# EAGLE board Seeeduino LoRaWan (EAGLE 7.6.0)
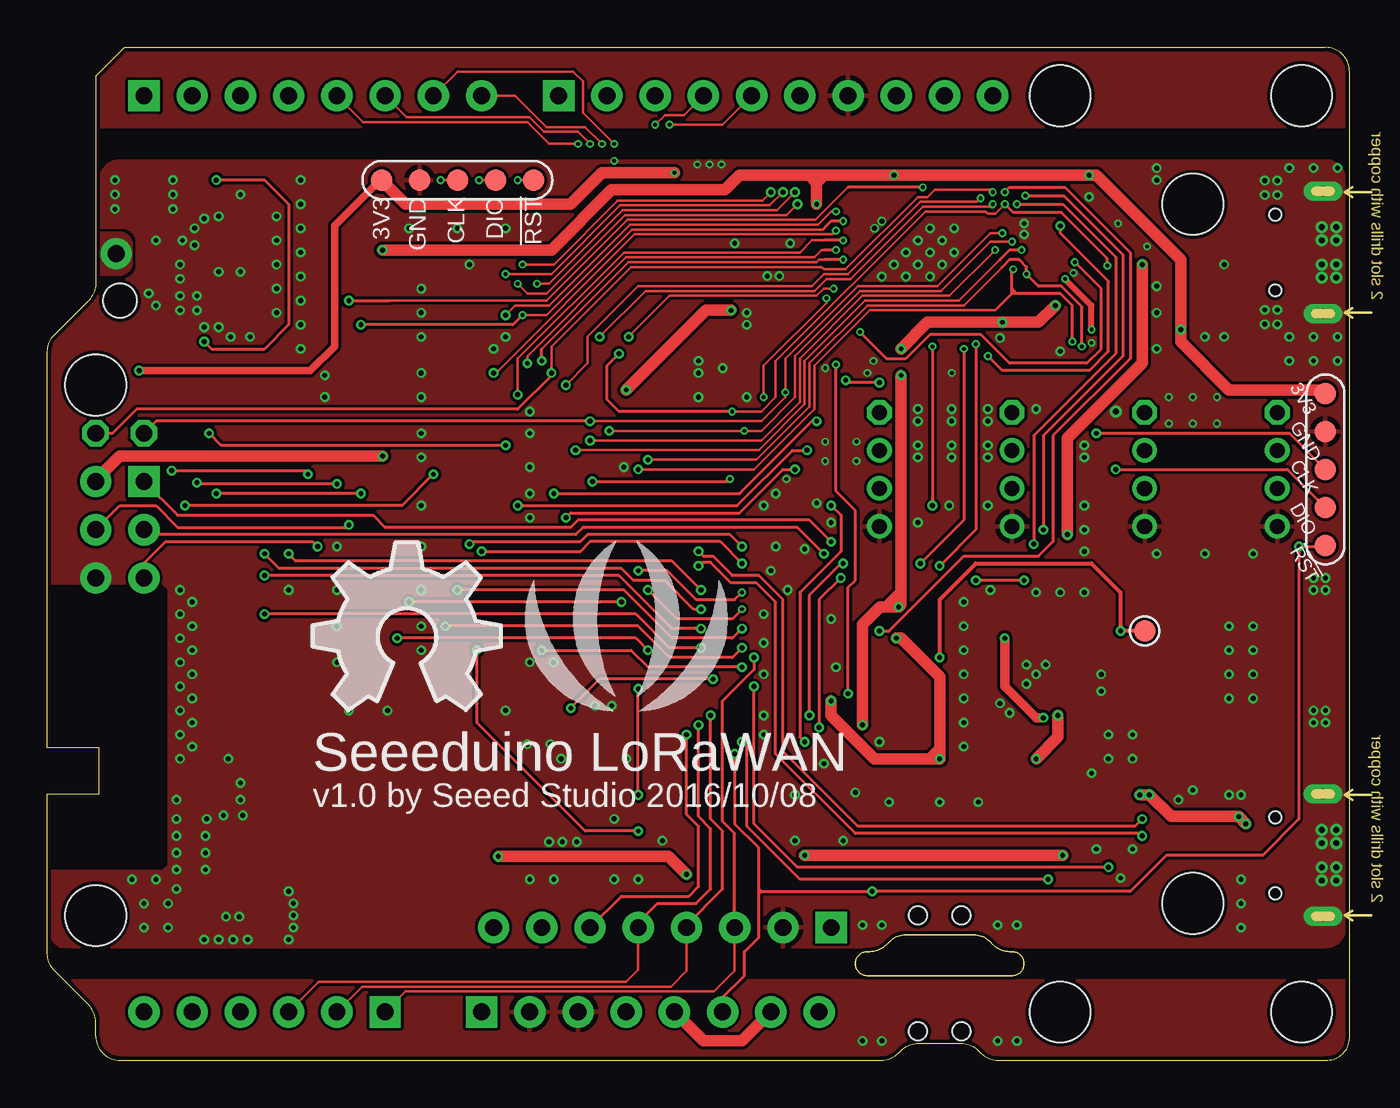
[diagram p2: board, top side]
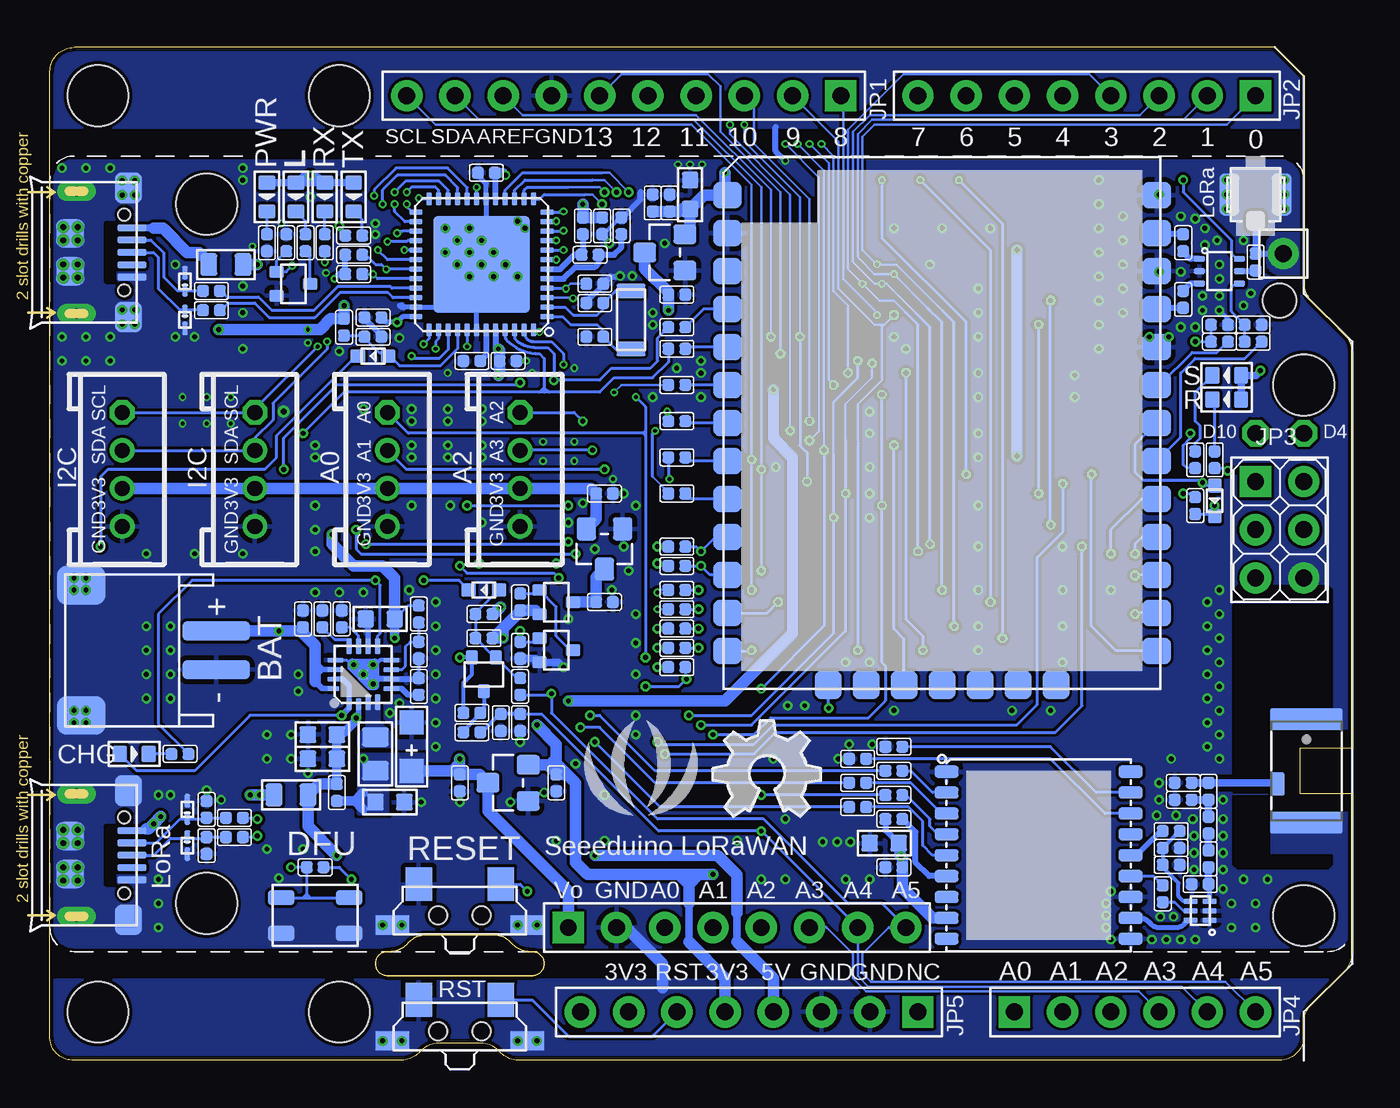
[diagram p3: board, bottom side, seen from below]

Size 68.58 x 53.34 mm. Coordinates in mm from the lower left corner, seen from the top.
Outline: 43.29,5.72 arc45 44.19,6.09 44.33,6.23 arc-45 45.23,6.6 48.75,6.6 arc-45 49.65,6.23 49.79,6.09 arc45 50.69,5.72
Outline: 50.67,5.72 50.8,5.72 arc-90 51.44,5.08 arc-90 50.8,4.45 43.18,4.45 arc-90 42.55,5.08 arc-90 43.18,5.72 43.31,5.72
Outline: 68.58,52.07 arc90 67.31,53.34 4.06,53.34 2.54,51.82 2.54,40.91 arc-45 2.17,40.01 0.37,38.22 arc45 0,37.32 0,16.45 2.73,16.45 2.73,14.03 0,14.03 0,5.61 arc45 0.37,4.71 2.17,2.91 arc-45 2.54,2.01 2.54,1.27 arc90 3.81,0 43.92,0 arc45 44.82,0.37 44.97,0.52 arc-45 45.87,0.89 48.12,0.89 arc-45 49.01,0.52 49.16,0.37 arc45 50.06,0 67.31,0 arc90 68.58,1.14 68.58,52.07
Copper layers (1*16): Top 0.035mm / dielectric 1.5mm / Bottom 0.035mm
Design rules "default *": minimum track width 1mil, minimum drill 8mil, track to track 5mil, track to pad 5mil, pad to pad 5mil, via to via 5mil, smd to smd 0mil, copper to edge 8mil, drill to drill 8mil, minimum pad ring 4mil, minimum via ring 4mil, stop-mask expansion 4mil, vias tented up to drill 20mil, thermal gap 10mil
Net classes: 0 default: width 0.025 mm, drill 0.203 mm, clearance 0.127 mm
Holes 3.2 mm at 60.33,45.09 60.33,8.26 66.04,2.54 66.04,50.8 53.34,2.54
Holes 1.78 mm at 3.81,40.01
tRestrict: area 2.5,47.6 to 68.6,48.9; area 0,4.4 to 68.6,5.7; 12 lines
bRestrict: area 42.9,39 to 48.8,44.8; area 51.1,19.3 to 53.1,21.3; area 6.1,14.2 to 7.8,15.1; area 0,4.4 to 68.6,5.7; area 2.5,47.6 to 68.6,48.9; 12 lines
Milling: area 42.5,4.4 to 51.4,6.6

## Footprints (pad centres in the part's own frame; a part is rotated, then mirrored left to right if it is on the bottom)
4P-2.0 = drill 0.8 pad 1.3 octagon: 1 -3,0 | drill 0.8 pad 1.3: 2 -1,0; 3 1,0; 4 3,0
1P-65/35MIL = drill 0.889 pad 1.651: 1 0,0
ANT3-SMD-5.2X3.7X0.7MM = smd 0.75 x 1.2: 1 1.525,0.7 | smd 3.8 x 1.15: 2 0,2.725; 3 0,-2.725
U-FL3P-SMD-2.6X2.6X1.0MM = smd 1.05 x 1: D -1.397,0 | smd 2.2 x 1.05: GND1 0,1.373; GND2 0,-1.373
HW2-SMD-2.0-90D = smd 2.032 x 2.54: 3 3.429,-2.159; 4 -3.429,-2.159 | smd 1.016 x 3.556: + -1.016,4.953; - 1.016,4.953
C0402 = smd 0.635 x 0.635: 1 -0.445,0; 2 0.445,0
C0603 = smd 0.889 x 0.889: 1 -0.762,0; 2 0.762,0
AVX-A = smd 1.27 x 1.27: + -1.27,0; - 1.27,0
LED-0603 = smd 0.762 x 0.889: + -0.762,0; - 0.762,0
SOD523 = smd 0.762 x 0.7: + -0.8,0; - 0.8,0
SOD-923 = smd 0.7 x 0.3: 1 -0.45,0; 2 0.45,0
MICRO-USB = smd 0.381 x 1.524: 1 -1.3,-0.25; 2 -0.65,-0.25; 3 0,-0.25; 4 0.65,-0.25; 5 1.3,-0.25 | smd 1.6 x 1.397: S1 -3.4,-0.427; S6 3.4,-0.427 | drill 0.508 pad 1.016 long: S2 -3.226,-3.175; S5 3.226,-3.175 | smd 1.5 x 1.5: S3 -1,-3.5; S4 1,-3.5 | hole 0.635: -2,-0.65; 2,-0.65
SW4P-SMD-4.5X3.2X2.5MM = smd 1.4 x 0.8: 1 -1.8,-0.94; 2 1.8,-0.94; 3 1.8,0.94; 4 -1.8,0.94
R0805 = smd 0.9 x 1.2: 1 -0.9,0; 2 0.9,0
H5-SMD-2.0-TEST = smd 1.143 x 1.143: 1 0,4; 2 0,2; 3 0,0; 4 0,-2; 5 0,-4
8P-2.54-65/35MIL = drill 0.889 pad 1.651 square: 1 0,8.89 | drill 0.889 pad 1.651: 2 0,6.35; 3 0,3.81; 4 0,1.27; 5 0,-1.27; 6 0,-3.81; 7 0,-6.35; 8 0,-8.89
L0402 = smd 0.635 x 0.635: 1 -0.445,0; 2 0.445,0
L0805 = smd 1.016 x 1.397: 1 -0.889,0; 2 0.889,0
SOT-323 = smd 0.635 x 0.762: 1 -0.635,-0.889; 2 0.635,-0.889; 3 0,0.889
SOT323 = smd 0.635 x 0.762: 1 -0.635,-0.889; 2 0.635,-0.889; 3 0,0.889
R0402 = smd 0.635 x 0.635: 1 -0.445,0; 2 0.445,0
4P-SMD-7.0X3.5X3.5H-90D = smd 1.397 x 1.778: 1 -2.159,1.651; 2 2.159,1.651 | smd 1.778 x 1.016: S1 -3.556,-0.508; S2 3.556,-0.508 | hole 0.95: -1.15,0; 1.15,0
DFN6-0.5-1.5X1.2X0.72MM = smd 0.3 x 0.75: 1 -0.5,-0.5; 2 0,-0.5; 3 0.5,-0.5; 4 0.5,0.5; 5 0,0.5; 6 -0.5,0.5
LGA18-1.1-9.7X10.1X2.5MM = smd 1.27 x 0.635: 1 4.85,-4.4; 2 4.85,-3.3; 3 4.85,-2.2; 4 4.85,-1.1; 5 4.85,0; 6 4.85,1.1; 7 4.85,2.2; 8 4.85,3.3; 9 4.85,4.4; 10 -4.85,4.4; 11 -4.85,3.3; 12 -4.85,2.2; 13 -4.85,1.1; 14 -4.85,0; 15 -4.85,-1.1; 16 -4.85,-2.2; 17 -4.85,-3.3; 18 -4.85,-4.4
SC-70 = smd 0.6 x 0.3: 1 -1.05,0.65; 2 -1.05,0; 3 -1.05,-0.65; 4 1.05,-0.65; 5 1.05,0; 6 1.05,0.65
MODULE33P-SMD-2.0-28X23X2.9MM = smd 1.5 x 1.4: 1 -11.3,26; 2 -11.3,24; 3 -11.3,22; 4 -11.3,20; 5 -11.3,18; 6 -11.3,16; 7 -11.3,14; 8 -11.3,12; 9 -11.3,10; 10 -11.3,8; 11 -11.3,6; 12 -11.3,4; 13 -11.3,2; 21 11.3,2; 22 11.3,4; 23 11.3,6; 24 11.3,8; 25 11.3,10; 26 11.3,12; 27 11.3,14; 28 11.3,16; 29 11.3,18; 30 11.3,20; 31 11.3,22; 32 11.3,24; 33 11.3,26 | smd 1.4 x 1.5: 14 -6,0.2; 15 -4,0.2; 16 -2,0.2; 17 0,0.2; 18 2,0.2; 19 4,0.2; 20 6,0.2
QFN48-7X7 = smd 0.7 x 0.3: 1 -3.45,2.75; 2 -3.45,2.25; 3 -3.45,1.75; 4 -3.45,1.25; 5 -3.45,0.75; 6 -3.45,0.25; 7 -3.45,-0.25; 8 -3.45,-0.75; 9 -3.45,-1.25; 10 -3.45,-1.75; 11 -3.45,-2.25; 12 -3.45,-2.75; 25 3.45,-2.75; 26 3.45,-2.25; 27 3.45,-1.75; 28 3.45,-1.25; 29 3.45,-0.75; 30 3.45,-0.25; 31 3.45,0.25; 32 3.45,0.75; 33 3.45,1.25; 34 3.45,1.75; 35 3.45,2.25; 36 3.45,2.75 | smd 0.3 x 0.7: 13 -2.75,-3.45; 14 -2.25,-3.45; 15 -1.75,-3.45; 16 -1.25,-3.45; 17 -0.75,-3.45; 18 -0.25,-3.45; 19 0.25,-3.45; 20 0.75,-3.45; 21 1.25,-3.45; 22 1.75,-3.45; 23 2.25,-3.45; 24 2.75,-3.45; 37 2.75,3.45; 38 2.25,3.45; 39 1.75,3.45; 40 1.25,3.45; 41 0.75,3.45; 42 0.25,3.45; 43 -0.25,3.45; 44 -0.75,3.45; 45 -1.25,3.45; 46 -1.75,3.45; 47 -2.25,3.45; 48 -2.75,3.45 | smd 5.1 x 5.1: PAD 0,0
SOT23 = smd 1.016 x 1.2: 1 -0.95,-1.06; 2 0.95,-1.06; 3 0,1.06
ARDUINO-38P = drill 0.889 pad 1.651 square: 1 63.5,50.8; 9 41.656,50.8; 19 50.8,2.54; 25 45.72,2.54; 38 63.5,30.48 | drill 0.889 pad 1.651: 2 60.96,50.8; 3 58.42,50.8; 4 55.88,50.8; 5 53.34,50.8; 6 50.8,50.8; 7 48.26,50.8; 8 45.72,50.8; 10 39.116,50.8; 11 36.576,50.8; 12 34.036,50.8; 13 31.496,50.8; 14 28.956,50.8; 15 26.416,50.8; 16 23.876,50.8; 17 21.336,50.8; 18 18.796,50.8; 20 53.34,2.54; 21 55.88,2.54; 22 58.42,2.54; 23 60.96,2.54; 24 63.5,2.54; 26 43.18,2.54; 27 40.64,2.54; 28 38.1,2.54; 29 35.56,2.54; 30 33.02,2.54; 31 30.48,2.54; 32 27.94,2.54; 33 66.04,30.48; 34 66.04,27.94; 35 66.04,25.4; 36 63.5,25.4; 37 63.5,27.94 | hole 3.2: 15.24,50.8; 66.04,35.56; 66.04,7.62
QFN16G-0.5-3X3MM = smd 0.65 x 0.28: 1 -1.575,0.75; 2 -1.575,0.25 | smd 0.85 x 0.28: 3 -1.475,-0.25; 4 -1.475,-0.75; 9 1.475,-0.75; 10 1.475,-0.25; 11 1.475,0.25; 12 1.475,0.75 | smd 0.28 x 0.85: 5 -0.75,-1.475; 6 -0.25,-1.475; 7 0.25,-1.475; 8 0.75,-1.475; 13 0.75,1.475; 14 0.25,1.475 | smd 0.28 x 0.65: 15 -0.25,1.575; 16 -0.75,1.575 | smd 0.508 x 0.508: PAD 0,0
TP_4545 = smd 1.143 x 1.143: T 0,0
X2-SMD-3.2X1.5X0.55MM = smd 0.762 x 1.524: 1 -1.524,0; 2 1.524,0

## Placement (x,y rotation side)
A0/A1  GROVE-DIP  [4P-2.0]  50.8,31.12 270 bottom
A2/A1  GROVE-DIP  [4P-2.0]  43.81,31.12 270 bottom
ANT  321050326/16cm Wire Antenna  [1P-65/35MIL]  3.62,42.48 0 bottom
ANT1  DNP  [ANT3-SMD-5.2X3.7X0.7MM]  2.4,15.24 180 bottom
ANT2  U.FL  [U-FL3P-SMD-2.6X2.6X1.0MM]  5.08,45.59 90 bottom
BAT  2.0 SMD JST  [HW2-SMD-2.0-90D]  64.77,21.59 270 bottom
C1  DNP  [C0402]  9.53,10.29 0 bottom
C2  DNP  [C0402]  9.53,11.18 0 bottom
C3  DNP  [C0402]  24.13,10.16 180 bottom
C4  DNP  [C0603]  24.64,11.43 180 bottom
C5  DNP  [C0402]  7.56,12.38 90 bottom
C6  DNP  [C0402]  7.56,14.16 90 bottom
C7  DNP  [C0402]  8.89,13.72 0 bottom
C8  DNP  [C0402]  8.89,14.61 0 bottom
C9  1uF  [C0402]  35.94,45.15 90 bottom
C10  1nF  [C0402]  6.99,38.74 0 bottom
C11  47pF  [C0402]  8.89,43.05 90 bottom
C12  47pF  [C0402]  5.08,42.04 270 bottom
C13  47pF  [C0402]  8.89,40.07 270 bottom
C14  1nF  [C0402]  5.21,38.74 180 bottom
C15  1uF  [C0402]  54.61,10.16 180 bottom
C16  12pF  [C0402]  39.88,38.1 0 bottom
C17  12pF  [C0402]  39.88,39.88 0 bottom
C18  100nF  [C0402]  39.88,40.89 180 bottom
C19  100nF  [C0402]  44.45,36.83 0 bottom
C20  1uF  [C0402]  39.5,43.94 270 bottom
C21  1uF  [C0402]  40.13,42.42 0 bottom
C22  1uF  [C0402]  46.35,36.83 180 bottom
C23  100nF  [C0402]  51.56,38.1 0 bottom
C24  100nF  [C0402]  51.56,39.12 180 bottom
C25  100nF  [C0402]  45.59,46.74 0 bottom
C26  1uF  [C0402]  35.56,40.32 180 bottom
C27  1uF  [C0402]  36.83,45.15 270 bottom
C28  22uF  [C0603]  34.86,45.59 270 bottom
C29  1uF  [C0402]  46.99,14.61 90 bottom
C30  1uF  [C0402]  41.91,14.61 90 bottom
C31  1uF  [C0402]  39.37,24.13 180 bottom
C32  1uF  [C0402]  39.37,29.85 180 bottom
C33  DNP  [C0402]  60.33,11.3 90 bottom
C34  DNP  [C0402]  60.33,13.21 270 bottom
C35  10uF  [C0603]  54.23,17.15 0 bottom
C36  10uF  [C0603]  54.23,15.88 0 bottom
C37  10uF  [C0603]  51.18,23.24 0 bottom
C38  10uF  [C0603]  50.67,13.59 180 bottom
C39  22uF/10v  [AVX-A]  49.53,16.51 90 bottom
C40  100nF  [C0402]  55.24,23.24 270 bottom
C41  12pF  [C0402]  44.83,17.78 270 bottom
CHG  RED  [LED-0603]  64.14,16.13 0 bottom
D1  1N4148WT  [SOD523]  7.24,29.46 270 bottom
D2  1N4148WT  [SOD523]  51.56,37.08 180 bottom
D3  DF2S6.8FS  [SOD-923]  61.47,38.99 270 bottom
D4  DF2S6.8FS  [SOD-923]  61.47,41.02 90 bottom
D5  DNP  [SOD-923]  61.34,11.3 270 bottom
D6  DNP  [SOD-923]  61.34,13.21 90 bottom
D7  1N4148WT  [SOD523]  45.72,24.77 180 bottom
DEBUG  DNP  [MICRO-USB]  64.01,10.8 270 bottom
DFU  BUTTON / 311020045  [SW4P-SMD-4.5X3.2X2.5MM]  54.61,7.62 0 bottom
F1  500mA  [R0805]  59.31,41.91 0 bottom
F2  DNP  [R0805]  55.88,13.97 0 bottom
FR  PAGE1  [SEEEDSTUDIO-PCB-FRAME]  167.8,0 0 bottom  (outside the outline)
FR1  PAGE1  [SEEEDSTUDIO-PCB-FRAME]  355.85,-6.6 0 bottom  (outside the outline)
I2C  GROVE-DIP  [4P-2.0]  64.77,31.12 270 bottom
I2C1  GROVE-DIP  [4P-2.0]  57.78,31.12 270 bottom
J1  DNP  [H5-SMD-2.0-TEST]  21.59,46.36 90 top
J2  DNP  [H5-SMD-2.0-TEST]  67.31,31.12 0 top
J3  DNP  [8P-2.54-65/35MIL]  32.38,6.99 90 bottom
J4  USB / 320010000  [MICRO-USB]  64.01,42.55 270 bottom
L  GREEN  [LED-0603]  55.63,45.47 270 bottom
L1  DNP  [L0402]  7.56,10.61 90 bottom
L2  DNP  [L0402]  8,9.27 0 bottom
L3  2.2uH  [L0805]  51.44,16.13 270 bottom
LED1  DNP  [LED-0603]  6.6,34.8 180 bottom
PWR  GREEN  [LED-0603]  57.15,45.47 270 bottom
Q1  CJ2102  [SOT-323]  55.75,40.89 270 bottom
Q2  CJ2101  [SOT323]  41.91,24.13 270 bottom
Q3  CJ2102  [SOT-323]  41.91,21.59 270 bottom
Q4  CJ2101  [SOT323]  45.72,20.32 180 bottom
R1  DNP  [R0402]  9.53,12.07 180 bottom
R2  DNP  [R0402]  9.97,8.76 90 bottom
R3  DNP  [R0402]  24.13,12.7 0 bottom
R4  DNP  [R0402]  26.04,13.34 0 bottom
R5  DNP  [R0402]  24.13,13.97 0 bottom
R6  DNP  [R0402]  26.04,15.88 180 bottom
R7  DNP  [R0402]  26.04,14.61 0 bottom
R8  DNP  [R0402]  24.13,16.51 180 bottom
R9  DNP  [R0402]  24.13,15.24 0 bottom
R11  1k  [R0402]  35.56,38.61 0 bottom
R12  1k  [R0402]  35.56,37.47 0 bottom
R14  DNP  [R0402]  35.56,35.56 0 bottom
R15  1k  [R0402]  6.99,37.85 180 bottom
R16  DNP  [R0402]  35.56,33.66 0 bottom
R17  DNP  [R0402]  35.56,31.75 0 bottom
R18  1k  [R0402]  5.21,37.85 180 bottom
R19  DNP  [R0402]  35.56,29.85 0 bottom
R20  DNP  [R0402]  35.56,24.77 180 bottom
R21  DNP  [R0402]  35.56,27.05 0 bottom
R22  DNP  [R0402]  35.56,23.75 180 bottom
R23  DNP  [R0402]  35.56,26.04 0 bottom
R24  1k  [R0402]  35.56,22.73 180 bottom
R25  1k  [R0402]  35.56,21.72 180 bottom
R26  1k  [R0402]  8.26,31.62 90 bottom
R27  DNP  [R0402]  7.24,31.62 90 bottom
R28  DNP  [R0402]  35.56,20.7 0 bottom
R29  DNP  [R0402]  8.26,29.21 90 bottom
R30  0R  [R0402]  38.48,43.94 270 bottom
R31  0R  [R0402]  40.51,43.94 270 bottom
R32  10k  [R0402]  53.09,38.61 90 bottom
R33  1k  [R0402]  55.12,43.05 90 bottom
R34  1k  [R0402]  52.58,43.43 0 bottom
R35  1k  [R0402]  54.1,43.05 90 bottom
R36  1k  [R0402]  57.15,43.05 90 bottom
R37  4.7k  [R0402]  52.58,41.4 180 bottom
R38  4.7k  [R0402]  52.58,42.42 180 bottom
R39  1M  [R0402]  56.13,43.05 270 bottom
R40  1M  [R0402]  43.81,24.13 90 bottom
R41  1M  [R0402]  43.81,21.59 270 bottom
R42  22R  [R0402]  60.07,40.51 0 bottom
R43  22R  [R0402]  60.07,39.5 0 bottom
R44  DNP  [R0402]  58.86,12.76 0 bottom
R45  DNP  [R0402]  58.86,11.75 0 bottom
R46  DNP  [R0402]  53.47,14.1 270 bottom
R47  0R  [R0402]  49.15,19.69 90 bottom
R48  DNP  [R0402]  49.15,23.5 90 bottom
R49  1M  [R0402]  45.72,22.23 0 bottom
R50  DNP  [R0402]  45.72,23.5 0 bottom
R51  10k  [R0402]  61.72,16.13 180 bottom
R52  10k  [R0402]  43.81,19.69 270 bottom
R53  0R  [R0402]  49.15,21.59 90 bottom
R54  2k  [R0402]  54.23,23.24 270 bottom
R55  2k  [R0402]  53.21,23.24 270 bottom
R56  DNP  [R0402]  46.35,18.29 180 bottom
R57  1M_1%  [R0402]  46.35,17.27 0 bottom
R58  100k_1%  [R0402]  43.81,17.78 270 bottom
RST  BUTTON / 3100060P1  [4P-SMD-7.0X3.5X3.5H-90D]  46.99,1.52 0 bottom
RST1  DNP  [4P-SMD-7.0X3.5X3.5H-90D]  46.99,7.62 0 bottom
RX  RED  [LED-0603]  54.1,45.47 270 bottom
T/R  YELLOW  [LED-0603]  6.6,36.07 180 bottom
TX  RED  [LED-0603]  52.58,45.47 270 bottom
U1  DNP  [DFN6-0.5-1.5X1.2X0.72MM]  8,7.87 90 bottom
U2  DNP  [LGA18-1.1-9.7X10.1X2.5MM]  16.51,10.8 180 bottom
U3  AS179_92LF  [SC-70]  6.99,41.56 0 bottom
U4  RHF76-052AM  [MODULE33P-SMD-2.0-28X23X2.9MM]  21.59,19.56 0 bottom
U5  ATSAMD21G18-QFN48  [QFN48-7X7]  45.85,41.91 180 bottom
U6  XC6206MR-3.3V  [SOT23]  36.2,42.55 90 bottom
U7  XC6206MR-3.3V  [SOT23]  44.45,14.61 90 bottom
U8  XC6206MR-3.3V  [SOT23]  39.37,26.92 180 bottom
U9  ARDUINO-38P  [ARDUINO-38P]  68.58,0 0 bottom
U10  ETA6003  [QFN16G-0.5-3X3MM]  52.07,20.32 90 bottom
U$1  [OSHW_FILLX350_NOTEXT]  13.97,18.42 0 top
U$2  [SEEEDSTUDIO-PCB-FRAME]  355.44,0 0 bottom  (outside the outline)
U$3  [SEEEDSTUDIO-PCB-FRAME]  261.62,0 0 bottom  (outside the outline)
U$17  [OSHW_FILLX200_NOTEXT_TNAME]  33.66,12.83 0 bottom
U$25  [SEEED-SILK-280*268MIL]  37.47,14.61 0 bottom
U$27  [SEEED-SILK-420X352]  30.48,22.86 0 top
VBAT  DNP  [TP_4545]  57.78,22.61 0 top
X1  32.768kHz  [X2-SMD-3.2X1.5X0.55MM]  37.97,38.99 270 bottom

## Tracks (layer width: path | path; a pad name or v marks a point on that pad's centre or on a via)
3V3  (via drill 0.2 pad 0.41, 0.25 pad 0.41, 0.25 pad 0.51)
  Top 0.305: v54.99,38.48 54.99,39.75 v53.59,41.15
  Top 0.61: U9.31 36.58,1.02 34.54,1.02 U9.29 | v44.96,37.47 46.35,38.86 v50.29,38.86 52.2,38.86 v53.09,39.75 | 40.89,46.61 v44.58,46.61 v54.86,46.61 55.24,46.61 59.69,42.16 v59.69,38.48 59.69,37.85 62.23,35.31 67.18,35.31 67.25,35.24 67.25,35.12 J2.1 | 40.89,46.61 40.51,46.61 | 40.51,46.61 40.13,46.61 | v40.51,45.09 40.51,46.23 | 40.51,46.23 40.51,46.61 | 40.51,46.23 40.89,46.61 | 40.51,46.23 40.13,46.61 | 40.13,46.61 36.45,46.61 35.69,45.85 29.72,45.85 26.54,42.67 v17.65,42.67 | v44.96,36.07 44.96,24.64 | 44.96,24.64 44.96,24 v44.83,23.88 44.32,23.88 | 44.32,23.88 43.84,23.88 42.93,22.96 v42.93,17.65 | v23.75,10.73 32.7,10.73 v33.66,9.78 | U9.33 2.54,30.54 3.81,31.81 v17.65,31.81 | 44.32,23.88 44.32,24 44.96,24.64
  Bottom 0.254: U5.36 49.99,39.16 v50.29,38.86 50.86,38.86 C24.1 | 55.37,46.48 55.24,46.61 v54.86,46.61 54.48,46.61 54.36,46.48 | 55.37,46.48 L.+ | 54.36,46.48 RX.+ | 55.37,46.48 54.36,46.48
  Bottom 0.305: U5.44 45.1,37.6 v44.96,37.47 | R38.2 R37.2 53.34,41.4 v53.59,41.15 | U5.17 45.1,46.68 C25.2 | C4.1 24.57,12.13 R3.1
  Bottom 0.406: 34.92,6.22 34.92,8.26 | TX.+ RX.+ L.+ PWR.+
  Bottom 0.508: C25.2 44.7,46.74 v44.58,46.61
  Bottom 0.61: U9.29 33.02,4.32 34.92,6.22 | U7.2 42.35,15.56 | 42.23,15.56 42.1,15.56 42.04,15.49 41.91,15.49 | R50.2 45.21,23.5 v44.83,23.88 | v44.96,37.47 44.9,37.4 C19.1 44.9,36.13 v44.96,36.07 | v59.69,38.48 v54.99,38.48 54.36,38.48 53.78,39.05 R32.2 v53.09,39.75 | C20.1 R31.1 v40.51,45.09 | 41.34,15.05 C30.2 41.91,15.49 | 41.34,15.05 40.89,14.61 40.89,10.41 40.26,9.78 35.43,9.78 | 41.91,15.49 41.91,15.62 | 41.91,15.88 41.91,16.64 v42.93,17.65 | 42.35,15.56 42.23,15.56 | 42.23,15.56 41.91,15.88 | 42.35,15.56 42.04,15.24 | 41.91,15.88 41.91,15.62 | 41.91,15.62 41.34,15.05 | U2.8 22.1,7.5 23.69,9.08 C3.1 23.69,10.67 v23.75,10.73 23.81,10.8 23.81,11.37 C4.1 | v33.66,9.78 34.42,9.78 | 34.42,9.78 34.92,9.78 | 34.92,9.78 35.43,9.78 | 34.92,8.26 34.92,9.27 | 34.92,9.27 34.92,9.78 | 35.43,9.78 34.92,9.27 | 34.92,9.27 34.42,9.78 | v17.65,42.67 v17.65,31.81
!CH_STATU  (via drill 0.25 pad 0.51)
  Top 0.152: v51.44,25.27 v48.9,25.27
  Bottom 0.152: U10.9 51.32,22.34 51.18,22.48 51.18,25.02 v51.44,25.27 61.09,25.27 62.87,23.5 62.87,17.72 R51.1 | D7.- 47.03,25.27 v48.9,25.27
!RESET  (via drill 0.25 pad 0.51)
  Top 0.152: U9.36 5.08,26.16 6.22,27.31 13.97,27.31 v14.22,27.05 | J2.5 67.25,27.05 v65.91,27.05 65.91,12.7 64.01,10.8 58.93,10.8 57.02,8.89 v43.43,8.89 37.59,8.89 | U9.30 35.56,3.3 36.7,4.45 36.7,5.72 37.47,6.48 37.47,8.76 | v36.2,16.13 36.2,12.45 37.47,11.18 37.47,9.02 | 37.47,8.76 37.47,8.89 | 37.47,8.89 37.47,9.02 | 37.47,8.89 37.59,8.89 | 37.59,8.89 37.47,9.02 | 37.59,8.89 37.47,8.76
  Bottom 0.152: RST.2 43.18,3.18 41.27,1.27 36.83,1.27 U9.30 | v65.91,27.05 65.91,30.73 65.53,31.12 57.28,31.12 56.64,31.75 56.64,32.89 52.45,37.08 D2.- | RST1.2 43.81,9.27 v43.43,8.89 | v14.22,27.05 14.22,18.67 15.62,17.27 30.35,17.27 31.5,16.13 v36.2,16.13
A0_PA02_AIN0  (via drill 0.2 pad 0.41, 0.25 pad 0.51)
  Top 0.127: U9.19 18.86,3.62 35.12,3.62 36.2,4.7 J3.3 | v41.02,40.13 41.02,39.88 37.72,36.58 v37.72,34.93
  Top 0.152: v37.21,21.21 37.21,20.57 35.56,18.92 35.56,12.57 36.2,11.94 J3.3
  Bottom 0.127: U5.3 41.05,40.16 v41.02,40.13
  Bottom 0.152: 37.21,33.02 37.34,33.02 | 37.34,33.02 49.7,33.02 A0/A1.1 | 37.21,33.15 37.21,34.42 v37.72,34.93 | 37.21,33.15 37.21,33.02 | 37.21,33.02 37.21,32.89 | 37.34,33.02 37.21,33.15 | 37.34,33.02 37.21,32.89 | 37.21,32.89 v37.21,21.21
A1_PB08_AIN2  (via drill 0.2 pad 0.41, 0.25 pad 0.51)
  Top 0.127: U9.20 16.57,3.87 32.83,3.87 33.66,4.7 J3.4 | 26.04,37.47 30.61,42.04 40.51,42.04 40.64,42.16 40.89,42.16
  Top 0.152: v41.91,42.16 40.89,42.16 | v39.37,31.12 38.73,31.12 36.45,28.83 27.56,28.83 v27.3,28.58 | J3.4 33.66,7.11 35.56,9.02 35.56,12.07 34.92,12.7 v34.92,18.16 | v26.04,36.83 26.04,37.47
  Bottom 0.127: 27.3,34.67 27.3,31.88
  Bottom 0.152: U5.7 v41.91,42.16 | 27.3,31.88 v27.3,28.58 27.3,22.48 31.62,18.16 v34.92,18.16 | v39.37,31.12 49.8,31.12 A0/A1.2 | 27.3,34.67 26.04,35.94 v26.04,36.83
A2_PB09_AIN3  (via drill 0.2 pad 0.41, 0.25 pad 0.51)
  Top 0.127: U9.21 14.29,4.13 30.48,4.13 31.11,4.76 J3.5 | 40.89,42.67 40.77,42.67 40.39,42.29 30.48,42.29 25.27,37.08 v25.27,36.7
  Top 0.152: v41.53,42.67 40.89,42.67 | v26.67,29.85 36.45,29.85 40.26,33.66 v40.51,33.66 | J3.5 31.11,7.24 32.13,8.26 34.16,8.26 34.92,9.02 34.92,12.19 34.29,12.83 v34.29,17.65
  Bottom 0.127: 26.67,32.64 26.67,34.54 25.27,35.94 v25.27,36.7
  Bottom 0.152: U5.8 v41.54,42.66 v41.53,42.67 | 26.67,32.64 v26.67,29.85 26.67,22.61 31.62,17.65 v34.29,17.65 | A2/A1.1 40.97,34.12 v40.51,33.66
A3_PA04_AIN4  (via drill 0.2 pad 0.41, 0.25 pad 0.51)
  Top 0.127: 40.89,43.18 40.26,43.18 39.62,42.55 30.35,42.55 24.77,36.96 v24.77,35.05
  Top 0.152: v41.91,43.18 40.89,43.18 | v40.01,32.13 39.99,32.12 39.23,32.12 36.32,29.21 v24.77,29.21 | J3.6 30.23,8.64 33.78,8.64 34.29,9.14 34.29,12.32 33.66,12.95 v33.66,17.15
  Bottom 0.127: U9.22 11.24,3.62 25.59,3.62 26.29,4.32 26.29,5.59 27.69,6.99
  Bottom 0.152: U5.9 41.93,43.16 v41.91,43.18 | v24.77,35.05 v24.77,29.21 24.77,20.96 24.57,20.77 24.57,18.92 25.46,18.03 30.61,18.03 31.5,17.15 v33.66,17.15 | v40.01,32.13 43.8,32.13 A2/A1.2 | 27.69,6.99 J3.6
A4_PA05_AIN5/VBAT  (via drill 0.2 pad 0.41, 0.25 pad 0.51)
  Top 0.127: 41.47,43.62 41.34,43.5 30.92,43.5 23.62,36.2 v23.5,36.2
  Top 0.152: v41.53,43.69 41.47,43.62 | v22.61,21.59 22.61,17.78 28.32,12.07 v31.11,12.07
  Bottom 0.127: U9.23 8.95,3.87 25.46,3.87 26.04,4.45 J3.7
  Bottom 0.152: J3.7 v31.11,12.07 36.51,12.07 42.67,18.22 R58.1 | U5.10 41.56,43.66 v41.53,43.69 | v23.5,36.2 23.5,23.24 22.61,22.35 v22.61,21.59
  Bottom 0.203: R58.1 C41.1 44.9,18.22 45.85,17.27 R57.2
A5_PB02_AIN10/!CHSTATU  (via drill 0.2 pad 0.41, 0.25 pad 0.51)
  Top 0.152: v42.16,19.3 42.16,24.89 42.55,25.27 42.55,28.96 41.53,29.97 v41.53,36.64
  Bottom 0.127: 24.38,6.99 25.78,5.59 25.78,4.57 25.34,4.13 6.67,4.13 U9.24
  Bottom 0.152: U5.47 43.6,38.33 arc-90 43.11,37.85 42.16,37.85 41.53,37.21 v41.53,36.64 | R52.2 42.23,19.24 v42.16,19.3 42.16,18.29 36.58,12.7 30.99,12.7 26.54,8.26 24.77,8.26 J3.8 24.38,6.99
ANTON
  Bottom 0.152: U2.13 10.46,9.7 R2.2
D0/RX_PA11_TCC0-W3  (via drill 0.2 pad 0.41, 0.25 pad 0.51)
  Top 0.127: v38.1,45.72 37.66,45.28 30.04,45.28 26.67,41.91 v25.02,41.91
  Top 0.152: v20.95,22.86 31.11,22.86 32.77,21.21 36.07,21.21 v36.58,21.72
  Bottom 0.127: 39.5,46.74 39.12,46.74 v38.1,45.72 | U9.1 6.6,49.28 25.15,49.28 25.78,48.64 25.78,42.67 v25.02,41.91 24,41.91 21.59,39.5
  Bottom 0.152: U5.16 44.6,45.83 43.69,46.74 39.5,46.74 | R25.2 v36.58,21.72 | v20.95,22.86 20.95,38.86 21.59,39.5
D1/TX_PA10_TCC0-W2  (via drill 0.2 pad 0.41, 0.25 pad 0.51)
  Top 0.127: v38.73,45.72 38.04,45.02 30.16,45.02 26.54,41.4 v24.13,41.4
  Top 0.152: v21.59,24.77 30.35,24.77 32.89,22.23 36.07,22.23 v36.58,22.73
  Bottom 0.127: 40.01,46.36 39.37,46.36 v38.73,45.72 | U9.2 8.89,49.53 25.27,49.53 26.04,48.77 26.04,42.29 25.15,41.4 v24.13,41.4 22.35,39.62 22.23,39.5
  Bottom 0.152: U5.15 44.1,45.82 43.56,46.36 40.01,46.36 | R24.2 v36.58,22.73 | v21.59,24.77 21.59,38.86 22.35,39.62
D2_PA08_TCC0-W0  (via drill 0.2 pad 0.41, 0.25 pad 0.51)
  Top 0.127: v39.5,45.09 38.92,44.51 30.42,44.51 26.29,40.39 25.27,40.39 v24.77,40.89
  Top 0.152: v22.23,27.18 22.35,27.31 28.07,27.31 28.45,27.69 35.94,27.69 v36.58,27.05
  Bottom 0.127: 40.39,45.59 40.01,45.59 v39.5,45.09 | U9.3 11.18,49.78 25.4,49.78 26.29,48.9 26.29,42.04 25.15,40.89 v24.77,40.89 24.51,40.89 22.99,39.37 22.86,39.24
  Bottom 0.152: U5.13 42.78,45.36 42.55,45.59 40.39,45.59 | v22.23,27.18 22.23,38.61 22.99,39.37 | R21.1 v36.58,27.05
D3_PA09_TCC0-W1  (via drill 0.2 pad 0.41, 0.25 pad 0.51)
  Top 0.127: v39.37,45.72 38.42,44.77 30.29,44.77 26.42,40.89 v25.78,40.89
  Top 0.152: v22.86,26.8 28.07,26.8 28.57,27.31 35.43,27.31 v36.58,26.16
  Bottom 0.127: 41.27,45.97 39.62,45.97 v39.37,45.72 | U9.4 13.84,51.94 23.62,51.94 26.54,49.02 26.54,41.66 v25.78,40.89 24.89,40.01 24.13,40.01 23.5,39.37
  Bottom 0.152: U5.14 43.6,45.81 43.43,45.97 41.27,45.97 | v22.86,26.8 22.86,38.74 23.5,39.37 | R23.1 36.45,26.04 v36.58,26.16
D4_PA14_TCC0-W4  (via drill 0.2 pad 0.41, 0.25 pad 0.51, 0.89 pad 1.4)
  Top 0.127: U9.5 16.64,49.4 25.27,49.4 26.42,48.26 v27.94,48.26 | v26.54,36.2 26.54,37.59 30.73,41.78 40.77,41.78 40.89,41.66 42.04,41.66 45.85,45.47 46.35,45.47 46.74,45.85 49.66,45.85 v49.78,45.72
  Top 0.152: v2.54,33.02 3.43,33.02 4.7,34.29 24.77,34.29 26.54,36.07 v26.54,36.2
  Bottom 0.127: v27.94,48.26 27.3,47.63 27.3,40.51 26.54,39.75 v26.54,36.2
  Bottom 0.152: U5.23 48.1,45.81 48.26,45.97 49.53,45.97 v49.78,45.72
D5_PA15_TCC0-W5  (via drill 0.2 pad 0.41, 0.25 pad 0.51)
  Top 0.127: v49.15,45.4 48.96,45.21 45.97,45.21 42.16,41.4 40.89,41.4 40.26,40.77 31.11,40.77 28.45,38.1 28.45,36.7 v27.3,35.56 | v28.57,48.26 27.94,48.9 26.16,48.9 25.4,49.66 18.92,49.66 U9.6
  Bottom 0.127: v28.57,48.26 27.56,47.24 27.56,35.81 v27.3,35.56
  Bottom 0.152: U5.24 49.11,45.36 v49.15,45.4
D6_PA20_TCC0-W6  (via drill 0.2 pad 0.41, 0.25 pad 0.51)
  Top 0.127: 49.78,42.55 47.5,40.26 42.93,40.26 39.62,36.96 39.62,34.67 37.59,32.64 v28.57,32.64 | U9.7 21.59,52.07 27.69,52.07 28.19,51.56 28.19,49.91 v29.84,48.26
  Top 0.152: v49.91,42.67 49.78,42.55
  Bottom 0.127: v29.84,48.26 28.07,46.48 28.07,33.15 v28.57,32.64
  Bottom 0.152: U5.29 v49.9,42.66 v49.91,42.67
D7_DGI_GPIO1/GPS_1PPS  (via drill 0.2 pad 0.41, 0.25 pad 0.51)
  Top 0.127: 50.16,42.16 48.01,40.01 43.05,40.01 39.88,36.83 39.88,34.54 37.47,32.13 v27.81,32.13 | v29.21,48.26 28.32,49.15 26.29,49.15 24.64,50.8 U9.8
  Top 0.152: v51.31,42.67 50.67,42.67 50.16,42.16 | v31.11,13.97 v31.11,19.56
  Bottom 0.127: v27.81,32.13 27.81,46.86 v29.21,48.26
  Bottom 0.152: U5.30 50.8,42.16 v51.31,42.67 | v27.81,32.13 27.81,22.86 v31.11,19.56 | R5.1 v31.11,13.97
D8_DGI_GPIO2/LORA_!RST  (via drill 0.2 pad 0.41, 0.25 pad 0.51)
  Top 0.127: 41.02,43.94 40.83,43.75 30.8,43.75 26.29,39.24 v25.02,39.24
  Top 0.152: v41.91,44.2 41.27,44.2 41.02,43.94 | v25.02,39.24 24.51,38.74 v16.51,38.74 | v16.51,29.85 v8.89,29.85
  Bottom 0.127: U9.9 26.8,50.67 26.8,41.15 25.02,39.37 v25.02,39.24
  Bottom 0.152: U5.11 41.95,44.16 v41.91,44.2 | v16.51,38.74 v16.51,29.85 | v8.89,29.85 8.45,29.85 R29.2
D9_DGI_GPIO3/LORA_DFU  (via drill 0.2 pad 0.41, 0.25 pad 0.51)
  Top 0.127: 41.34,44.7 41.27,44.7 40.58,44.01 30.67,44.01 26.42,39.75 24.64,39.75 v24.13,39.24
  Top 0.152: v41.53,44.7 41.34,44.7 | v26.04,21.59 30.73,21.59 31.62,20.7 v36.58,20.7
  Bottom 0.127: U9.10 27.05,48.39 27.05,40.64 25.15,38.74 24.89,38.74 | 24.77,38.74 24.77,38.61 | v24.13,39.24 24.64,38.74 | 24.64,38.74 24.77,38.74 | 24.77,38.74 24.89,38.74 | 24.77,38.61 24.64,38.74 | 24.89,38.74 24.77,38.61 | 24.77,38.61 24.77,35.81 26.04,34.54 26.04,32.51
  Bottom 0.152: U5.12 41.57,44.66 v41.53,44.7 | R28.1 v36.58,20.7 | 26.04,32.51 v26.04,21.59
D10_SS  (via drill 0.2 pad 0.41, 0.25 pad 0.51, 0.89 pad 1.4)
  Top 0.127: v50.29,43.56 49.66,43.56 46.86,40.77 42.67,40.77 38.86,36.96 v38.86,35.18 38.86,34.93 37.59,33.66 v28.57,33.66
  Top 0.152: v28.57,33.66 5.71,33.66 v5.08,33.02
  Bottom 0.127: v28.57,33.66 28.57,45.34 31.5,48.26 31.5,50.29 U9.11 | 50.01,43.66 50.19,43.66 v50.29,43.56 | R14.1 38.48,35.56 v38.86,35.18
  Bottom 0.152: U5.27 50.01,43.66
D11_MOSI  (via drill 0.2 pad 0.41, 0.25 pad 0.51)
  Top 0.127: v32,49.28 32.51,49.78 33.53,49.78 U9.12 | v29.08,38.1 31.5,40.51 40.39,40.51 41.02,41.15 42.29,41.15 46.1,44.96 49.66,44.96 v49.78,45.09
  Top 0.152: v28.7,30.48 35.81,30.48 v35.94,30.61
  Bottom 0.127: v29.08,38.1 29.08,45.47 32,48.39 v32,49.28
  Bottom 0.152: R17.1 36.01,30.67 v35.94,30.61 | v29.08,38.1 29.08,32.39 28.7,32 v28.7,30.48 | U5.25 49.49,44.66 49.78,44.96 v49.78,45.09
D12_MISO  (via drill 0.2 pad 0.41, 0.25 pad 0.51)
  Top 0.127: U9.13 35.56,49.28 v32.77,49.28 | v29.59,33.15 v36.7,33.15 37.59,33.15 39.37,34.93 39.37,37.08 42.8,40.51 47.05,40.51 49.66,43.12 v50.8,43.12
  Bottom 0.127: v29.59,33.15 29.59,45.59 32.77,48.77 v32.77,49.28 | R19.1 36.01,29.91 36.83,30.73
  Bottom 0.152: 36.83,30.73 36.83,33.02 v36.7,33.15 | U5.28 49.74,43.16 49.78,43.12 v50.8,43.12
D13_SCK  (via drill 0.2 pad 0.41, 0.25 pad 0.51)
  Top 0.127: v36.07,34.16 37.59,34.16 38.35,34.93 38.35,36.83 46.23,44.7 49.4,44.7 49.53,44.58 49.91,44.58 v50.42,45.09
  Top 0.152: v55.82,41.85 55.82,42.23 53.4,44.64 50.86,44.64 v50.42,45.09 | v30.1,37.21 29.46,36.58 29.46,34.8 30.1,34.16 v36.07,34.16
  Bottom 0.127: v30.1,37.21 30.1,45.72 33.27,48.9 33.27,51.31 33.91,51.94 38.48,51.94 U9.14 | R16.1 36.01,34.1 v36.07,34.16
  Bottom 0.152: 56.13,42.42 R39.2 56.64,42.1 Q1.1 56.13,41.53 v55.82,41.85 | U5.26 49.88,44.16 50.42,44.7 v50.42,45.09
D22/PA12_S4_SPI_MISO  (via drill 0.2 pad 0.41, 0.25 pad 0.51)
  Top 0.152: U9.38 6.86,28.7 17.14,28.7 17.78,28.07 27.56,28.07 27.94,28.45 40.13,28.45 v41.27,27.31 | v51.05,45.09 53.47,45.09 56.26,42.29 56.26,37.21 51.94,32.89 v51.94,27.18
  Bottom 0.152: U5.21 47.1,45.95 47.75,46.61 50.29,46.61 51.05,45.85 v51.05,45.09 | v51.94,27.18 41.4,27.18 v41.27,27.31
D23/PB10_S4_SPI_MOSI  (via drill 0.2 pad 0.41, 0.25 pad 0.51)
  Top 0.127: 42.16,45.97 40.45,44.26 30.54,44.26 26.29,40.01 18.03,40.01
  Top 0.152: U9.34 3.81,29.21 5.71,29.21 6.86,28.07 15.75,28.07 v15.88,28.19 | v46.1,45.97 42.16,45.97 | v15.88,40.01 18.03,40.01
  Bottom 0.152: U5.19 v46.1,45.97 | v15.88,28.19 v15.88,40.01
D24/PB11_S4_SPI_SCK  (via drill 0.2 pad 0.41, 0.25 pad 0.51)
  Top 0.152: v52.45,27.94 52.45,32.89 56.64,37.08 56.64,42.42 53.53,45.53 v51.5,45.53 | v40.89,26.67 39.5,28.07 28.19,28.07 27.81,27.69 5.33,27.69 U9.37
  Bottom 0.152: U5.20 46.6,45.96 47.62,46.99 50.35,46.99 51.5,45.85 v51.5,45.53 | v52.45,27.94 52.45,26.92 52.2,26.67 v40.89,26.67
D25/PB03_RX_LED  (via drill 0.2 pad 0.41)
  Top 0.152: v54.1,42.04 55.5,40.64 55.5,37.47 54.74,36.7 50.67,36.7 49.15,38.23 46.48,38.23 45.21,36.96 44.2,36.96 v42.8,38.35
  Bottom 0.152: R35.1 v54.1,42.04 | U5.48 42.91,38.46 v42.8,38.35
D26/PA27_TX_LED  (via drill 0.2 pad 0.41, 0.25 pad 0.51)
  Top 0.152: v53.34,43.94 53.34,43.56 55.88,41.02 55.88,37.34 54.86,36.32 50.29,36.32 v49.53,37.08
  Bottom 0.152: R34.1 53.02,43.62 v53.34,43.94 | U5.39 47.6,37.43 48.07,36.96 49.4,36.96 v49.53,37.08
D27/PA28_USB_HOST_EN/GPS_STANDBY  (via drill 0.2 pad 0.41, 0.25 pad 0.51)
  Top 0.152: v46.61,37.59 v46.61,29.21 | v41.27,29.21 41.78,28.7 41.78,26.8 39.62,24.64 39.62,17.02 v39.88,16.76
  Bottom 0.152: U5.41 46.6,37.6 v46.61,37.59 | v46.61,29.21 v41.27,29.21 | R4.1 36.45,13.34 v39.88,16.76
D30/TXD/PB22/GPS  (via drill 0.2 pad 0.41, 0.25 pad 0.51)
  Top 0.152: v48.9,37.72 48.9,27.94 v46.99,26.04 | v41.78,25.4 40.64,24.26 v40.64,17.53
  Bottom 0.152: U5.37 48.6,38.02 v48.9,37.72 | v46.99,26.04 46.61,25.65 42.04,25.65 v41.78,25.4 | R7.1 36.7,14.61 39.62,17.53 v40.64,17.53
D31/RXD/PB23/GPS  (via drill 0.2 pad 0.41, 0.25 pad 0.51)
  Top 0.152: v48.26,37.47 48.26,28.45 v45.97,26.16 | v41.91,26.16 41.78,26.16 40.13,24.51 v40.13,18.16
  Bottom 0.152: U5.38 48.1,38.01 48.26,37.85 v48.26,37.47 | v45.97,26.16 v41.91,26.16 | R9.1 36.7,15.24 39.62,18.16 v40.13,18.16
D32/SDA/PA22  (via drill 0.2 pad 0.41, 0.25 pad 0.51)
  Top 0.127: 50.04,39.62 49.91,39.5 43.31,39.5 40.39,36.58 40.39,34.29 37.21,31.12 v31.11,31.12
  Top 0.152: v53.98,37.85 53.98,39.75 53.34,40.39 51.05,40.39 | 51.05,40.39 50.8,40.39 | 50.8,40.39 50.04,39.62 | 50.8,40.39 50.8,40.64 | 50.8,40.64 50.8,41.59 v50.86,41.66 | v31.11,25.78 32.64,25.78 34.16,24.26 36.2,24.26 v36.58,24.64 | 51.05,40.39 50.8,40.64
  Bottom 0.127: U9.17 45.97,49.53 34.67,49.53 31.11,45.97 v31.11,31.12 v31.11,25.78
  Bottom 0.152: I2C.2 I2C1.2 57.78,32.77 56.83,33.72 56.83,34.61 53.98,37.47 v53.98,37.85 | R38.1 51.94,42.42 51.44,41.91 51.12,41.91 v50.86,41.66 U5.31 | R20.2 36.45,24.77 v36.58,24.64
D33/SCL/PA23  (via drill 0.2 pad 0.41, 0.25 pad 0.51)
  Top 0.127: 50.29,41.78 48.26,39.75 43.18,39.75 40.13,36.7 40.13,34.42 37.34,31.62 v31.62,31.62
  Top 0.152: v54.48,37.59 54.48,39.69 53.4,40.77 52.2,40.77 v51.56,41.4 51.56,41.78 51.18,42.16 50.67,42.16 50.29,41.78 | v31.62,24.77 33.15,23.24 36.07,23.24 v36.58,23.75
  Bottom 0.127: U9.18 48.26,49.28 34.8,49.28 31.62,46.1 v31.62,31.62 v31.62,24.77 | v36.58,23.75 R22.2
  Bottom 0.152: I2C.1 I2C1.1 57.78,34.29 v54.48,37.59 | U5.32 51.32,41.16 v51.56,41.4 R37.1
D38/ATN/GROVE_POWER_EN/DGI_GPIO0  (via drill 0.2 pad 0.41, 0.25 pad 0.51)
  Top 0.152: v50.42,45.72 50.67,45.97 53.59,45.97 57.02,42.55 57.02,36.96 52.96,32.89 52.96,27.31 52.2,26.54 48.26,26.54 44.32,22.61 v43.81,22.61
  Bottom 0.152: Q3.1 42.99,22.04 R41.1 v43.81,22.61 | U5.22 47.6,45.82 48.07,46.29 49.85,46.29 v50.42,45.72
D42/AREFA_PA03  (via drill 0.2 pad 0.41, 0.25 pad 0.51)
  Top 0.127: v30.61,38.1 32.77,40.26 40.51,40.26 40.89,40.64 v41.4,40.64
  Bottom 0.127: v41.4,40.64 41.15,40.89 C18.2 | v30.61,38.1 30.61,45.85 34.54,49.78 43.69,49.78 U9.16
  Bottom 0.152: U5.4 41.42,40.66 v41.4,40.64
DFU  (via drill 0.25 pad 0.51)
  Top 0.152: v55.88,10.16 39.5,10.16 37.21,12.45 v37.21,19.69 | v35.05,20.07 29.08,20.07 v27.56,18.54
  Bottom 0.152: DFU.4 55.12,8.56 | 55.12,8.56 DFU.3 | 55.05,8.76 C15.2 v55.88,10.16 | 55.05,8.76 55.05,8.62 55.12,8.56 | 55.05,8.76 55.24,8.57 | 55.05,8.76 54.86,8.57 | R28.2 35.12,20.13 v35.05,20.07 35.43,19.69 v37.21,19.69 | U4.14 27.59,18.57 v27.56,18.54
GND  (via drill 0.2 pad 0.41, 0.25 pad 0.41, 0.25 pad 0.51, 0.3 pad 0.64)
  Bottom 0.127: 52.45,20.57 52.45,20.7 v52.58,20.83
  Bottom 0.152: U10.13 52.95,21.07 52.45,20.57 | R53.1 R47.2 | v43.94,44.2 43.94,43.82 v45.21,42.55
  Bottom 0.203: U10.8 51.19,21.07 51.44,20.83 51.44,20.07 | C10.2 6.54,39.05 v6.99,39.5 | R30.1 38.54,44.39 39.43,43.5 C20.2
  Bottom 0.254: C18.1 39.43,41.08 | U5.42 46.1,40.89 | 45.6,42.93 U5.18 45.6,46.17 46.04,46.61 | 47.62,40.01 47.97,39.66 U5.35 50.07,39.66 50.16,39.75
  Bottom 0.279: 51.82,20.57 U10.PAD | U10.10 51.82,23.12 C37.1
  Bottom 0.305: U10.PAD 51.82,20.07 51.44,20.07 U10.6 49.21,20.07 R47.2 | 48.1,39.66 v46.48,41.28 46.1,40.89 | 45.6,42.93 v45.21,42.55 | C25.1 46.04,46.61 | C20.2 39.5,43.41 v39.12,43.03 | R30.1 38.42,44.39 37.47,45.34 37.47,45.72 | 49.95,39.66 50.04,39.75 | C23.2 51.12,38.16 52.01,39.05 C24.2 | C17.1 40.32,39.94 39.43,40.83 C18.1 39.05,41.28 38.56,41.28 v38.53,41.3 | v29.84,47.37 30.35,47.88 30.35,49.15
  Bottom 0.406: R41.2 42.99,21.15 Q3.2 41.78,20.96 v41.53,20.7
  Bottom 0.61: 36.32,3.81 36.32,5.08 38.23,6.99 J3.2
  other vias: 10.29,12.89 9.27,12.89 8.38,12.7 8.32,10.03 8.32,10.92 8.32,11.81 6.35,6.99 6.35,8.26 6.79,9.02 6.79,10.03 6.79,10.92 6.79,11.81 6.79,12.7 6.79,13.72 6.99,15.88 6.99,17.15 6.99,18.42 6.99,19.69 6.99,20.96 6.99,22.23 6.99,23.5 6.99,24.77 7.62,24.13 7.62,22.86 7.62,21.59 7.62,20.32 7.62,19.05 7.62,17.78 7.62,16.51 5.71,9.53 4.45,9.53 5.08,8.26 5.08,6.99 10.1,7.56 9.4,7.56 12.7,8.89 12.95,8.26 12.95,7.62 12.95,6.99 12.7,6.35 10.54,6.35 9.78,6.35 9.02,6.35 8.26,6.35 55.5,19.43 55.5,20.32 50.67,18.29 50.16,18.8 52.07,20.32 51.56,20.83 51.56,19.81 53.34,24.64 52.07,24.64 56.39,44.07 45.85,41.91 45.21,41.28 46.48,42.55 37.91,41.3 25.27,16.64 27.05,15.88 27.88,11.49 30.48,15.88 46.99,13.59 44.32,13.59 42.55,14.1 38.99,24.77 38.35,27.05 38.35,29.85 62.23,13.97 60.33,14.22 54.99,15.11 55.88,17.15 67.31,18.42 62.23,19.05 26.67,9.53 41.27,23.24 39.88,26.92 41.27,28.32 40.51,29.34 45.85,28.32 47.5,29.21 49.53,29.21 54.61,29.21 66.67,18.42 66.67,25.4 67.31,25.4 34.23,47.18 34.86,47.18 35.5,47.18 47.62,36.2 43.5,36.83 50.16,38.04 57.91,42.86 58.42,46.99 49.02,13.59 48.26,19.05 48.26,20.32 50.04,7.11 51.05,1.02 50.04,1.02 43.94,1.02 42.93,1.02 51.44,44.07 54.04,41.47 40.96,36.45 40.96,32.58 42.61,32.58 42.61,31.56 40.96,31.56 67.88,43.88 67.31,24.77 66.67,24.77 67.31,17.78 66.67,17.78 29.84,12.7 27.11,11.49 32.38,11.56 31.11,9.53 39.37,11.56 39.37,13.97 41.91,11.56 40.89,15.62 43.81,16.76 37.72,17.15 37.72,18.16 37.72,20.32 37.72,21.97 37.72,23.5 38.1,25.78 43.18,36.2 38.93,30.61 37.72,29.21 48.26,21.59 48.26,24.13 49.66,24.77 48.26,22.86 62.23,21.59 54.61,24.64 54.61,26.8 59.05,33.53 60.33,33.53 60.33,34.93 59.05,34.93 25.4,20.96 25.4,29.85 25.4,33.02 25.4,31.24 25.4,34.16 19.68,22.86 19.68,24.77 19.68,27.05 19.68,29.21 19.68,31.75 19.68,33.02 19.68,34.93 19.68,36.2 19.68,39.37 19.68,40.64 22.23,41.91 24.13,43.82 21.59,43.82 15.24,24.77 15.24,22.86 15.24,20.96 15.24,27.05 14.61,34.93 24.13,38.1 23.5,37.47 19.68,38.1 14.61,36.07 12.7,24.77 19.68,21.59 25.4,28.58 19.05,43.82 34.29,36.83 34.29,36.2 34.29,34.93 36.83,34.93 35.56,36.45 36.83,39.37 36.83,38.74 51.44,43.5 54.99,37.78 59.56,13.72 55.88,15.88 63.5,26.67 58.42,26.67 67.94,36.83 67.94,38.1 64.77,39.52 63.5,21.59 63.5,22.86 62.23,22.86 60.96,26.67 58.42,37.47 29.84,9.53 26.42,11.49 24.13,18.42 17.91,18.42 15.88,18.42 10.16,14.61 10.16,13.72 9.53,15.88 26.48,16.64 29.72,18.67 28.83,18.67 26.67,20.96 30.35,31.24 45.85,31.75 45.85,32.39 45.85,33.66 45.85,34.29 47.62,34.29 47.62,33.66 47.62,32.39 47.62,31.75 49.53,34.29 49.53,32.39 49.53,33.66 49.53,31.75 52.07,34.29 54.61,32.39 54.61,31.75 54.61,27.94 55.24,11.11 57.15,11.11 56.52,9.59 63.5,19.05 62.87,13.97 62.87,6.99 7.87,40.26 9.02,41.53 10.16,41.53 10.16,45.59 10.67,38.1 6.99,40.26 5.71,39.75 5.71,43.18 5.33,40.39 7.11,43.18 7.75,42.93 7.75,43.82 8.26,44.32 9.02,44.45 7.87,39.5 8.26,38.61 9.02,38.61 6.6,46.36 6.6,45.59 6.6,44.83 3.56,44.83 3.56,45.59 3.56,46.36 13.34,45.09 13.34,43.82 13.34,42.55 13.34,41.28 13.34,40.01 13.34,38.74 13.34,46.36 9.65,38.1 51.05,7.11 43.94,7.11 42.93,7.11 62.87,8.26 62.87,9.53 63.5,20.32 62.23,20.32 48.26,17.78 48.26,16.51 57.15,17.15 57.15,15.88 66.67,36.83 58.42,39.37 58.42,46.36 36.2,43.03 25.4,9.53 46.48,43.82 47.75,43.82 47.75,42.55 47.12,43.18 45.85,43.18 44.58,41.91 43.94,41.28 47.12,41.91 43.56,43.82 13.34,37.47 12.06,39.37 12.06,40.64 12.06,41.91 12.06,43.18 12.06,44.45 6.99,41.91 6.99,41.15 61.59,34.93 61.59,33.53 53.34,37.34 56.26,34.16 54.86,45.47 61.98,41.91 66.67,38.1 58.42,40.77 64.11,38.76 64.11,39.52 64.77,38.76 64.77,46.33 64.11,45.57 64.11,46.33 64.77,45.57 67.94,46.99 66.67,46.99 65.41,46.99 65.41,38.1 65.41,36.83 61.98,38.1 60.96,38.1 67.12,43.88 67.12,43.18 67.88,43.18 67.88,41.91 67.12,41.91 67.12,41.21 67.88,41.21 67.88,12.13 67.12,12.13 67.12,11.43 67.88,11.43 67.88,10.16 67.12,10.16 67.12,9.46 67.88,9.46
  pour Bottom (isolate 0.152, rank 6): 68.58,53.34 2.54,53.34 2.54,48.9 68.58,48.9
  pour Top (isolate 0.152, rank 6): 68.58,53.34 2.54,53.34 2.54,48.9 68.58,48.9
  pour Bottom (rank 6, no thermals): 6.73,5.97 6.73,13.97 8,13.97 8,15.24 6.73,15.24 6.73,26.67 -1.27,26.67 -1.27,15.24 6.35,15.24 6.35,13.97 -1.27,13.97 -1.27,5.97
  pour Top (rank 6, no thermals): 6.73,5.97 6.73,26.67 -1.27,26.67 -1.27,5.97
  pour Top (isolate 0.152, rank 6): 68.58,4.45 1.27,4.45 1.27,0 68.58,0
  pour Bottom (isolate 0.152, rank 6): 68.58,4.45 1.27,4.45 1.27,0 68.58,0
  pour Bottom (isolate 0.152, rank 6): 68.58,47.63 0,47.63 0,5.72 67.31,5.72 67.31,4.95 68.58,4.95
  pour Top (isolate 0.152, rank 6): 68.58,47.63 0,47.63 0,5.72 67.31,5.72 67.31,5.33 68.58,5.33
  pour Bottom (isolate 0.152, rank 6, no thermals): 8.26,47.63 2.54,47.63 2.54,43.94 8.26,43.94
GNDA
  Bottom 0.305: U5.5 41.52,41.16 40.89,41.78 39.88,41.78 39.69,41.97 C21.2 38.86,42.42 38.48,42.8 R30.2
GROVE_3V3
  Bottom 0.61: U8.2 39.81,28.49 C32.2 40.08,30.12 A2/A1.3 A0/A1.3 I2C1.3 I2C.3
HF  (via drill 0.25 pad 0.51)
  Top 0.152: v8.89,46.36 11.43,46.36 12.7,45.09 12.7,38.74 11.43,37.47 8.64,37.47 v8.26,37.85
  Bottom 0.152: v8.89,46.36 8.89,45.72 6.35,43.18 6.35,42.48 6.08,42.21 U3.6 | C10.1 R15.2 v8.26,37.85
L_RST  (via drill 0.25 pad 0.51)
  Top 0.152: v52.7,9.53 39.62,9.53 36.83,12.32 36.83,16.51 v36.58,16.76 | v15.24,30.35 7.94,30.35 v7.87,30.42
  Bottom 0.152: C15.1 53.34,10.16 v52.7,9.53 | v15.24,30.35 15.24,27.81 16.57,26.48 16.57,18.73 17.65,17.65 30.48,17.65 31.5,16.64 36.45,16.64 v36.58,16.76 | D1.+ 7.72,30.26 v7.87,30.42 8,30.54 10.99,30.54 11.43,30.99 11.43,32.42 U4.27
LED1  (via drill 0.25 pad 0.51)
  Top 0.152: v6.54,31.05 13.53,31.05 v13.72,30.86
  Bottom 0.152: U4.21 12.41,21.56 13.72,22.86 v13.72,30.86 | R27.1 6.67,31.18 v6.54,31.05
LED2  (via drill 0.25 pad 0.51)
  Top 0.152: v24.13,32.39 9.14,32.39 v8.51,33.02
  Bottom 0.152: U4.16 23.59,22.19 24.13,22.73 v24.13,32.39 | R26.1 8.7,31.18 8.89,31.37 8.89,32.39 8.51,32.77 v8.51,33.02
LF
  Bottom 0.152: R18.2 C14.2 6.35,39.43 6.35,40.7 6.15,40.91 U3.4
LIPO_BAT  (via drill 0.25 pad 0.51)
  Top 0.152: 56.51,24.63 56.52,24.64
  Top 0.203: v46.99,21.21 46.99,24.26 48.9,26.16 54.99,26.16 56.52,24.64 v56.52,22.61 VBAT.T
  Bottom 0.203: v46.99,21.21 Q4.2 46.35,20.32 46.8,19.88 R56.2
  Bottom 0.279: U10.16 54.24,19.57 54.61,19.94 | U10.14 54.23,20.57 | 54.23,20.57 54.61,20.96 | 54.23,20.57 54.61,20.19
  Bottom 0.61: 54.61,19.94 54.61,20.19 54.61,20.96 54.61,21.84 55.24,22.48 | BAT.+ v56.52,22.61 55.37,22.61 55.24,22.48 | C40.2 55.24,22.48
LORA_3V3  (via drill 0.2 pad 0.41, 0.25 pad 0.51)
  Top 0.406: J1.1 17.53,46.36 15.11,43.94 15.11,37.59 13.84,36.32 v4.83,36.32
  Top 0.61: v33.02,46.74 29.21,46.74 27.56,45.09 18.86,45.09 J1.1
  Bottom 0.406: v4.83,36.32 5.08,36.07 T/R.+ LED1.+
  Bottom 0.61: C28.2 34.13,45.56 U4.1 33.02,45.69 v33.02,46.74 | C27.2 C9.1 35.43,44.7 35.31,44.83 C28.2 | C28.2 34.86,43.77 U6.2
LORA_!RESET  (via drill 0.2 pad 0.41, 0.25 pad 0.51)
  Top 0.127: J1.5 v24.77,46.36
  Top 0.152: v20.32,30.86 18.67,29.21 v7.24,29.21
  Bottom 0.152: v24.77,46.36 24.77,43.31 20.32,38.86 v20.32,30.86 | R29.1 7.34,28.77 D1.- v7.24,29.21
LORA_DM  (via drill 0.25 pad 0.51)
  Top 0.152: v57.66,12.7 57.28,12.32 42.67,12.32 38.73,16.26 38.73,24.26 37.47,25.53 36.07,25.53 35.05,26.54 34.54,26.54 v34.29,26.8
  Bottom 0.152: R44.2 57.72,12.76 v57.66,12.7 | R21.2 34.54,27.05 v34.29,26.8 33.53,27.56 U4.10
LORA_DP  (via drill 0.25 pad 0.51)
  Top 0.152: v57.66,11.81 57.53,11.94 42.55,11.94 38.35,16.13 38.35,24.13 37.34,25.15 36.01,25.15 34.92,26.23 34.48,26.23 v34.29,26.04
  Bottom 0.152: R45.2 57.72,11.75 v57.66,11.81 | U4.11 33.81,25.56 v34.29,26.04 R23.2
LORA_SWCLK  (via drill 0.2 pad 0.41, 0.25 pad 0.51)
  Top 0.127: J1.3 v20.7,46.36
  Top 0.152: v18.41,22.23 30.99,22.23 v31.62,21.59
  Bottom 0.152: v18.41,22.23 18.41,44.07 v20.7,46.36 | U4.13 31.66,21.56 v31.62,21.59
LORA_SWDIO  (via drill 0.2 pad 0.41, 0.25 pad 0.51)
  Top 0.127: J1.4 v22.73,46.36
  Top 0.152: v30.23,24.13 v19.05,24.13
  Bottom 0.152: v19.05,24.13 19.05,42.67 v22.73,46.36 | U4.12 30.8,23.56 v30.23,24.13
N$1
  Bottom 0.152: Q1.3 54.86,42.36 R33.1
N$2
  Bottom 0.152: R34.2 52.13,44.26 TX.-
N$3
  Bottom 0.406: C5.2 C6.1 C7.2
N$4
  Bottom 0.152: R35.2 RX.-
N$5
  Bottom 0.152: R33.2 55.12,44.2 L.-
N$6
  Bottom 0.406: C8.2 C6.2 3.99,14.61 ANT1.1
N$7
  Bottom 0.152: J4.3 63.12,42.55 62.87,42.29 62.87,40.64 61.72,39.5 61.47,39.5 | D3.1 61.47,39.5 | R43.1 61.47,39.5
N$8
  Bottom 0.254: U1.3 7.5,9.22 L2.2
  Bottom 0.406: L2.2 L1.1
N$9
  Bottom 0.152: DEBUG.3 63.12,10.8 62.23,11.68 61.34,11.68 | 61.34,11.68 60.39,11.68 C33.2 R45.1 | D5.1 61.34,11.68
N$10
  Bottom 0.152: J4.2 63.26,43.2 62.56,42.49 62.56,41.22 61.85,40.51 61.47,40.51 | R42.1 61.47,40.51 | D4.1 61.47,40.51
N$11
  Bottom 0.406: L1.2 C5.1
N$12
  Bottom 0.152: R36.2 PWR.-
N$13
  Bottom 0.152: U1.5 8.89,7.87 9.34,8.32 R2.1
N$14
  Bottom 0.203: U1.4 8.88,8.37 9.14,8.64 9.14,9.34 9.97,10.16 C1.1 C2.1 R1.1
N$15  (via drill 0.25 pad 0.51)
  Top 0.61: v57.53,13.97 v58.04,13.97 59.18,12.83 v62.74,12.83 v63.12,12.45
  Bottom 0.356: DEBUG.1 63.6,12.1 63.5,12.19
  Bottom 0.61: F2.1 v58.04,13.97 | 63.5,12.19 63.37,12.19 v63.12,12.45 v62.74,12.83
N$16
  Bottom 0.152: U2.16 12.99,13 15.88,15.88 R6.1
N$17
  Bottom 0.152: U2.17 13.46,14.1 15.88,16.51 R8.1
N$18
  Bottom 0.305: U2.6 22.27,9.7 22.99,10.41 22.99,12 R3.2
N$19
  Bottom 0.152: U2.5 22.1,10.8 22.61,11.3 22.61,12.57 23.37,13.34 R4.2
N$20
  Bottom 0.152: U2.4 21.8,11.9 22.23,12.32 22.23,12.7 23.5,13.97 R5.2
N$21
  Bottom 0.152: R48.1 R53.2 49.59,22.04 49.85,21.78 49.85,20.77 50.04,20.57 U10.7
N$22
  Bottom 0.152: U10.11 52.32,22.35 52.77,22.8 R55.2
N$25
  Bottom 0.152: DEBUG.2 62.98,11.45 61.72,12.7 61.34,12.7 | 61.34,12.7 60.39,12.7 C34.2 R44.1 | D6.1 61.34,12.7
N$26
  Bottom 0.305: U3.5 5.11,41.56 C12.2
N$27
  Bottom 0.305: C11.2 10.23,43.5 U4.32
N$28
  Bottom 0.305: C13.2 10.22,39.62 U4.30
N$31
  Bottom 0.152: U10.12 52.82,22.14 53.57,22.14 R54.2
N$32  (via drill 0.25 pad 0.51)
  Top 0.152: v34.42,22.73 32.89,22.73 30.1,25.53 v11.43,25.53
  Bottom 0.152: R24.1 v34.42,22.73 | U4.23 11.4,25.56 v11.43,25.53
N$33
  Bottom 0.279: U10.5 50.05,19.57 49.72,19.24 R47.1
N$34  (via drill 0.25 pad 0.51)
  Top 0.152: v34.42,21.72 32.77,21.72 30.99,23.5 v11.43,23.5
  Bottom 0.152: R25.1 v34.42,21.72 | U4.22 11.37,23.56 v11.43,23.5
N$35
  Bottom 0.152: U4.4 34.17,39.56 R11.2
N$36
  Bottom 0.152: U4.5 35.02,37.56 R12.2
N$37
  Bottom 0.152: R51.2 CHG.-
N$38
  Bottom 0.203: R57.1 46.8,17.34 45.91,18.22 R56.1 45.72,18.48 Q4.3
N$39  (via drill 0.25 pad 0.51)
  Top 0.152: v34.42,24.77 32.89,26.29 13.08,26.29 v12.7,26.67
  Bottom 0.152: R20.1 v34.42,24.77 | U4.25 11.08,29.56 12.7,27.94 v12.7,26.67
N$40  (via drill 0.25 pad 0.51)
  Top 0.152: v34.42,23.75 34.04,23.75 32.51,25.27 30.86,25.27 30.23,25.91 12.19,25.91 v11.43,26.67
  Bottom 0.152: R22.1 v34.42,23.75 | U4.24 11.05,27.56 11.43,27.18 v11.43,26.67
N$41
  Bottom 0.152: U4.9 34.83,29.56 R19.2
N$42
  Bottom 0.152: U4.8 34.92,31.56 R17.2
N$43
  Bottom 0.152: U4.7 35.02,33.56 R16.2
N$44
  Bottom 0.152: U4.6 R14.2
N$45
  Bottom 0.61: Q2.3 C31.2 39.81,25.42 U8.3
N$46
  Bottom 0.152: R26.2 8.26,32.51 8,32.77 8,33.4 8.26,33.66 8.26,35.18 T/R.-
N$48
  Bottom 0.152: R27.2 7.24,34.67 LED1.-
N$51
  Bottom 0.152: R15.1 7.11,37.28 8.42,37.28 10.14,35.56 U4.28
N$52
  Bottom 0.152: R18.1 5.65,36.96 8.26,36.96 9.02,36.2 9.02,32.83 U4.26
N$53
  Bottom 0.152: R40.2 42.99,24.58 Q2.1 41.91,23.88 41.91,22.35 41.15,21.59 Q3.3
N$54
  Bottom 0.152: D7.+ 44.96,24.77 46.16,23.56 R50.1 R49.1 45.15,21.21 Q4.1 44.01,20.13 R52.1
N$55
  Bottom 0.305: U3.1 8.45,42.21 arc45 8.63,42.28 8.89,42.55 C11.1
N$56
  Bottom 0.305: U3.3 8.45,40.91 arc-45 8.63,40.83 8.89,40.58 C13.1
N$57
  Bottom 0.305: ANT2.D C12.1 ANT.1
  pour Top (isolate 0.152, no thermals): 2.54,41.4 3.81,41.4 arc90 4.45,42.04 4.45,42.93 arc90 3.81,43.56 2.54,43.56
  pour Bottom (isolate 0.152, no thermals): 2.54,41.4 3.81,41.4 arc90 4.45,42.04 4.45,42.93 arc90 3.81,43.56 2.54,43.56
N$84
  pour Bottom (isolate 0.203, no thermals): 51.24,19.18 51.24,17.84 50.55,17.15 50.55,16.51 52.32,16.51 52.32,17.15 51.88,17.59 51.88,19.18
PA00_XIN32
  Bottom 0.152: U5.1 41.57,39.16 41.15,38.74 39.75,38.74 39.43,38.42 C16.2 38.8,37.47 X1.2
PA01_XOUT32
  Bottom 0.152: U5.2 41.44,39.66 41.02,39.24 39.75,39.24 39.43,39.56 C17.2 38.8,40.51 X1.1
PA30_SWCLK  (via drill 0.25 pad 0.51)
  Top 0.152: v55.24,33.02 65.41,33.02 J2.3
  Bottom 0.152: U5.45 44.6,38.11 arc-45 44.52,37.91 arc-45 42.82,37.21 42.8,37.21 42.55,36.96 42.55,35.43 | 42.29,35.18 39.62,35.18 38.86,35.94 36.83,35.94 36.01,36.77 R12.1 | 42.29,35.18 42.55,35.18 | 42.55,35.18 42.8,35.18 | 42.8,35.18 53.09,35.18 v55.24,33.02 | 42.55,35.43 42.55,35.18 | 42.8,35.18 42.55,35.43 | 42.55,35.43 42.29,35.18
PA31_SWDIO  (via drill 0.25 pad 0.51)
  Top 0.152: v56.26,31.12 65.31,31.12 J2.4 | v43.81,35.69 42.16,35.69 v42.04,35.81
  Bottom 0.152: U5.46 44.1,38.04 arc-45 44.07,37.97 44.03,37.94 arc-45 43.05,37.53 42.35,37.53 42.04,37.21 v42.04,35.81 39.62,35.81 38.99,36.45 36.96,36.45 36.58,36.83 36.58,38.04 R11.1 | v43.81,35.69 43.94,35.56 53.47,35.56 56.26,32.77 v56.26,31.12
RF_IN
  Bottom 0.254: U1.6 arc-45 8.72,7.28 8.83,7.17 arc45 9.28,6.99 10.15,6.99 arc45 10.6,7.17 10.74,7.31 arc-45 11.19,7.5 U2.11
RXD1
  Bottom 0.152: U2.3 21.63,13 23.24,14.61 R7.2
TARGET_RESET
  Bottom 0.152: D2.+ 50.67,37.08 50.16,36.58 48.01,36.58 47.1,37.49 U5.40 | D2.+ 51.05,37.08 | R32.1 52.07,38.16 C23.1 52.01,38.04 51.24,37.28 50.93,37.28 50.93,37.25 D2.+
TARGET_USB-N
  Bottom 0.152: R42.2 59.56,40.51 59.24,40.2 57.59,40.2 56.9,39.5 54.67,39.5 53.4,40.77 50.67,40.77 50.57,40.66 U5.33
TARGET_USB-P
  Bottom 0.152: R43.2 59.56,39.5 59.18,39.88 57.78,39.88 57.02,39.12 54.61,39.12 53.28,40.45 50.8,40.45 50.51,40.16 U5.34
TXD1
  Bottom 0.152: U2.2 22.1,14.1 23.24,15.24 R9.2
U5V  (via drill 0.25 pad 0.51)
  Top 0.508: v50.42,22.23 50.42,19.69 52.07,18.03 v52.45,18.03
  Top 0.61: v53.47,10.8 v39.88,10.8 | v57.66,41.91 57.66,36.7 53.72,32.77 v53.72,27.69
  Bottom 0.152: C37.2 49.72,23.94 R48.2
  Bottom 0.279: U10.2 52.32,18.17 v52.45,18.03 | C35.2 53.21,17.15 53.09,17.27
  Bottom 0.406: 32.38,6.22 32.38,7.75
  Bottom 0.508: C35.2 C36.2 R46.1 | 53.09,17.27 52.45,17.91 v52.45,18.03 | C37.2 v50.42,22.23
  Bottom 0.61: U9.28 30.48,4.32 32.38,6.22 | R46.1 54.41,14.54 F2.2 54.98,12.31 v53.47,10.8 | 32.38,7.75 32.38,9.77 33.41,10.8 v39.88,10.8 | F1.2 v57.66,41.91 | v53.72,27.69 53.72,27.18 52.58,26.04 51.05,26.04 50.42,25.4 C37.2
USB5V
  Bottom 0.356: J4.1 63.15,43.85 63.12,43.82
  Bottom 0.61: 63.12,43.82 62.61,43.82 61.34,42.55 60.71,42.55 60.21,42.05 F1.1
VCC_RF
  Bottom 0.254: U2.14 11.63,10.8 arc-45 11.18,10.98 10.19,11.98 arc45 R1.2
VDDA
  Bottom 0.305: U5.6 41.72,41.66 40.96,42.42 C21.1 40.51,42.48 R31.2
VDDCORE
  Bottom 0.305: U5.43 45.6,37.14 C22.1
VIN  (via drill 0.25 pad 0.51)
  Top 0.61: v53.21,18.16 53.21,17.02 v52.07,15.88 | 46.99,16.38 v46.99,15.88 46.48,15.88 | 46.99,16.38 46.99,20.19 44.96,22.23 v44.7,22.23 | v30.48,35.31 34.67,39.5 v36.01,39.5 | 46.48,15.88 43.56,15.88 41.27,18.16 v41.27,18.92 | 46.48,15.88 46.99,16.38
  Bottom 0.152: v53.21,18.16 58.04,18.16 60.96,15.24 64.01,15.24 CHG.+
  Bottom 0.279: U10.15 53.15,20.07 52.82,19.74 U10.1 52.82,18.55 v53.21,18.16
  Bottom 0.508: R46.2 52.51,13.65 | 52.51,13.65 52.07,13.21 | 52.51,13.65 52.07,14.1
  Bottom 0.61: Q2.2 42.99,23.69 R40.1 43.81,23.62 44.7,22.73 | C29.2 46.99,15.37 | 46.99,15.37 46.99,15.62 | 46.99,15.62 v46.99,15.88 | C39.+ 47.37,15.24 | 47.37,15.24 47.18,15.24 C29.2 | 47.37,15.24 46.99,15.62 | C29.2 46.67,15.05 | 46.67,15.05 45.95,15.05 U7.3 45.51,13.13 41.27,8.89 J3.1 | 46.67,15.05 46.99,15.37 | 44.7,22.73 v44.7,22.23 R49.2 45.21,22.23 44.7,22.73 | v30.48,35.31 30.48,32.77 29.46,31.75 29.46,22.48 33.02,18.92 v41.27,18.92 | v36.01,39.5 C26.2 36.01,40.45 37.26,41.7 U6.3
  pour Bottom (isolate 0.203, rank 2, no thermals): 48.9,16.13 48.9,14.48 50.8,14.48 50.8,12.95 52.32,12.95 52.32,16.13

## Text on the board
tNames: 3V3 | GND | CLK | DIO | !RST | 3V3 | GND | CLK | DIO | !RST | Seeeduino LoRaWAN | v1.0 by Seeed Studio 2016/10/08
bNames: 0 | 1 | 2 | 3 | 4 | 5 | 6 | 7 | 8 | 9 | 10 | 11 | 12 | 13 | GND | AREF | SDA | SCL | TX | RX | L | PWR | LoRa | S | R | A2 | A0 | SCL | SCL | D4 | D10 | A3 | A1 | SDA | SDA | A2 | A0 | I2C | I2C | 3V3 | 3V3 | 3V3 | 3V3 | GND | GND | GND | GND | + | BAT | - | CHG | Seeeduino LoRaWAN | RESET | DFU | A5 | A4 | A3 | A2 | A1 | A0 | GND | Vo | LoRa | A5 | A4 | A3 | A2 | A1 | A0 | NC | GND | GND | 5V | 3V3 | RST | 3V3 | RST
bValues: 8p female | 10p female | 2x3 male | 6p female | 8p female